# Altium schematic sheet Archim_TF_Bottom.SchDoc
size Tabloid
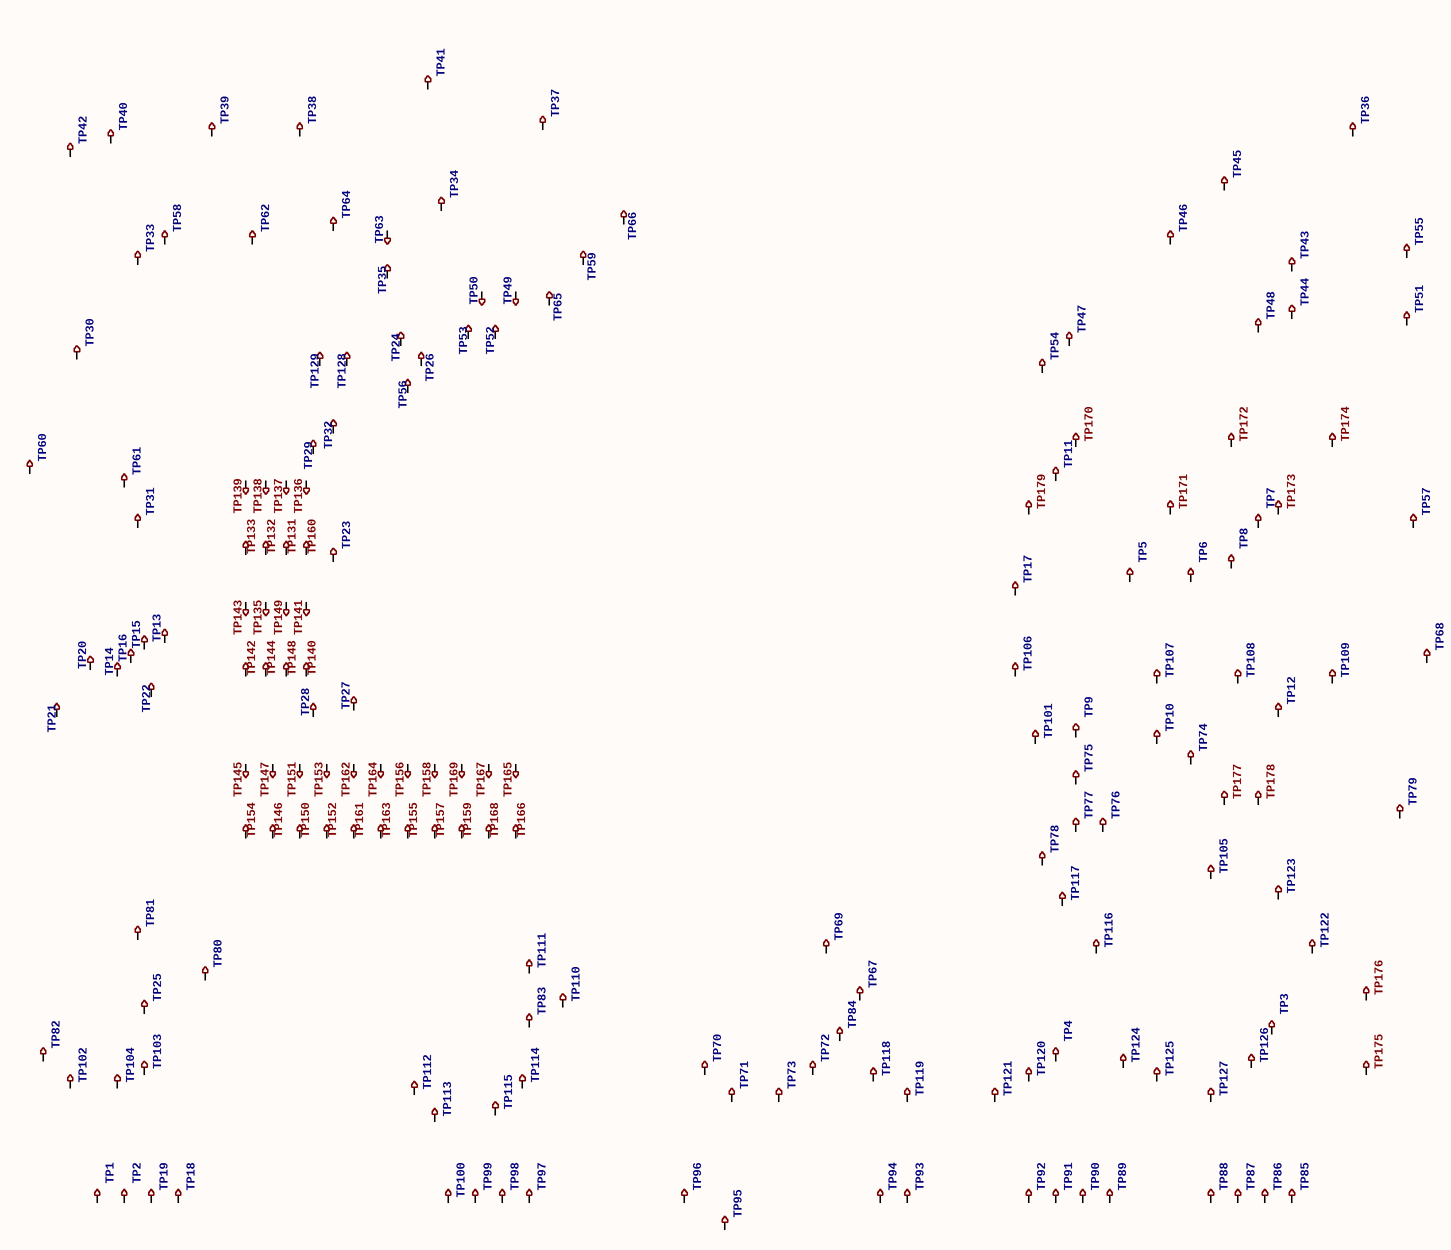
[diagram p0: Archim_TF_Bottom.SchDoc]

## Parts
TP1  P100-T  [POGO_38]  (value not drawn)  (no BOM)
TP2  P100-T  [POGO_38]  (value not drawn)  (no BOM)
TP3  P100-T  [POGO_38]  (value not drawn)  (no BOM)
TP4  P100-T  [POGO_38]  (value not drawn)  (no BOM)
TP5  P100-T  [POGO_38]  (value not drawn)  (no BOM)
TP6  P100-T  [POGO_38]  (value not drawn)  (no BOM)
TP7  P100-T  [POGO_38]  (value not drawn)  (no BOM)
TP8  P100-T  [POGO_38]  (value not drawn)  (no BOM)
TP9  P100-T  [POGO_38]  (value not drawn)  (no BOM)
TP10  P100-T  [POGO_38]  (value not drawn)  (no BOM)
TP11  P100-T  [POGO_38]  (value not drawn)  (no BOM)
TP12  P100-T  [POGO_38]  (value not drawn)  (no BOM)
TP13  P100-T  [POGO_38]  (value not drawn)  (no BOM)
TP14  P100-T  [POGO_38]  (value not drawn)  (no BOM)
TP15  P100-T  [POGO_38]  (value not drawn)  (no BOM)
TP16  P100-T  [POGO_38]  (value not drawn)  (no BOM)
TP17  P100-T  [POGO_38]  (value not drawn)  (no BOM)
TP18  P100-T  [POGO_38]  (value not drawn)  (no BOM)
TP19  P100-T  [POGO_38]  (value not drawn)  (no BOM)
TP20  P100-T  [POGO_38]  (value not drawn)  (no BOM)
TP21  P100-T  [POGO_38]  (value not drawn)  (no BOM)
TP22  P100-T  [POGO_38]  (value not drawn)  (no BOM)
TP23  P100-T  [POGO_38]  (value not drawn)  (no BOM)
TP24  P100-T  [POGO_38]  (value not drawn)  (no BOM)
TP25  P100-T  [POGO_38]  (value not drawn)  (no BOM)
TP26  P100-T  [POGO_38]  (value not drawn)  (no BOM)
TP27  P100-T  [POGO_38]  (value not drawn)  (no BOM)
TP28  P100-T  [POGO_38]  (value not drawn)  (no BOM)
TP29  P100-T  [POGO_38]  (value not drawn)  (no BOM)
TP30  P100-T  [POGO_38]  (value not drawn)  (no BOM)
TP31  P100-T  [POGO_38]  (value not drawn)  (no BOM)
TP32  P100-T  [POGO_38]  (value not drawn)  (no BOM)
TP33  P100-T  [POGO_38]  (value not drawn)  (no BOM)
TP34  P100-T  [POGO_38]  (value not drawn)  (no BOM)
TP35  P100-T  [POGO_38]  (value not drawn)  (no BOM)
TP36  P100-T  [POGO_38]  (value not drawn)  (no BOM)
TP37  P100-T  [POGO_38]  (value not drawn)  (no BOM)
TP38  P100-T  [POGO_38]  (value not drawn)  (no BOM)
TP39  P100-T  [POGO_38]  (value not drawn)  (no BOM)
TP40  P100-T  [POGO_38]  (value not drawn)  (no BOM)
TP41  P100-T  [POGO_38]  (value not drawn)  (no BOM)
TP42  P100-T  [POGO_38]  (value not drawn)  (no BOM)
TP43  P100-T  [POGO_38]  (value not drawn)  (no BOM)
TP44  P100-T  [POGO_38]  (value not drawn)  (no BOM)
TP45  P100-T  [POGO_38]  (value not drawn)  (no BOM)
TP46  P100-T  [POGO_38]  (value not drawn)  (no BOM)
TP47  P100-T  [POGO_38]  (value not drawn)  (no BOM)
TP48  P100-T  [POGO_38]  (value not drawn)  (no BOM)
TP49  P100-T  [POGO_38]  (value not drawn)  (no BOM)
TP50  P100-T  [POGO_38]  (value not drawn)  (no BOM)
TP51  P100-T  [POGO_38]  (value not drawn)  (no BOM)
TP52  P100-T  [POGO_38]  (value not drawn)  (no BOM)
TP53  P100-T  [POGO_38]  (value not drawn)  (no BOM)
TP54  P100-T  [POGO_38]  (value not drawn)  (no BOM)
TP55  P100-T  [POGO_38]  (value not drawn)  (no BOM)
TP56  P100-T  [POGO_38]  (value not drawn)  (no BOM)
TP57  P100-T  [POGO_38]  (value not drawn)  (no BOM)
TP58  P100-T  [POGO_38]  (value not drawn)  (no BOM)
TP59  P100-T  [POGO_38]  (value not drawn)  (no BOM)
TP60  P100-T  [POGO_38]  (value not drawn)  (no BOM)
TP61  P100-T  [POGO_38]  (value not drawn)  (no BOM)
TP62  P100-T  [POGO_38]  (value not drawn)  (no BOM)
TP63  P100-T  [POGO_38]  (value not drawn)  (no BOM)
TP64  P100-T  [POGO_38]  (value not drawn)  (no BOM)
TP65  P100-T  [POGO_38]  (value not drawn)  (no BOM)
TP66  P100-T  [POGO_38]  (value not drawn)  (no BOM)
TP67  P100-T  [POGO_38]  (value not drawn)  (no BOM)
TP68  P100-T  [POGO_38]  (value not drawn)  (no BOM)
TP69  P100-T  [POGO_38]  (value not drawn)  (no BOM)
TP70  P100-T  [POGO_38]  (value not drawn)  (no BOM)
TP71  P100-T  [POGO_38]  (value not drawn)  (no BOM)
TP72  P100-T  [POGO_38]  (value not drawn)  (no BOM)
TP73  P100-T  [POGO_38]  (value not drawn)  (no BOM)
TP74  P100-T  [POGO_38]  (value not drawn)  (no BOM)
TP75  P100-T  [POGO_38]  (value not drawn)  (no BOM)
TP76  P100-T  [POGO_38]  (value not drawn)  (no BOM)
TP77  P100-T  [POGO_38]  (value not drawn)  (no BOM)
TP78  P100-T  [POGO_38]  (value not drawn)  (no BOM)
TP79  P100-T  [POGO_38]  (value not drawn)  (no BOM)
TP80  P100-T  [POGO_38]  (value not drawn)  (no BOM)
TP81  P100-T  [POGO_38]  (value not drawn)  (no BOM)
TP82  P100-T  [POGO_38]  (value not drawn)  (no BOM)
TP83  P100-T  [POGO_38]  (value not drawn)  (no BOM)
TP84  P100-T  [POGO_38]  (value not drawn)  (no BOM)
TP85  P100-T  [POGO_38]  (value not drawn)  (no BOM)
TP86  P100-T  [POGO_38]  (value not drawn)  (no BOM)
TP87  P100-T  [POGO_38]  (value not drawn)  (no BOM)
TP88  P100-T  [POGO_38]  (value not drawn)  (no BOM)
TP89  P100-T  [POGO_38]  (value not drawn)  (no BOM)
TP90  P100-T  [POGO_38]  (value not drawn)  (no BOM)
TP91  P100-T  [POGO_38]  (value not drawn)  (no BOM)
TP92  P100-T  [POGO_38]  (value not drawn)  (no BOM)
TP93  P100-T  [POGO_38]  (value not drawn)  (no BOM)
TP94  P100-T  [POGO_38]  (value not drawn)  (no BOM)
TP95  P100-T  [POGO_38]  (value not drawn)  (no BOM)
TP96  P100-T  [POGO_38]  (value not drawn)  (no BOM)
TP97  P100-T  [POGO_38]  (value not drawn)  (no BOM)
TP98  P100-T  [POGO_38]  (value not drawn)  (no BOM)
TP99  P100-T  [POGO_38]  (value not drawn)  (no BOM)
TP100  P100-T  [POGO_38]  (value not drawn)  (no BOM)
TP101  P100-T  [POGO_38]  (value not drawn)  (no BOM)
TP102  P100-T  [POGO_38]  (value not drawn)  (no BOM)
TP103  P100-T  [POGO_38]  (value not drawn)  (no BOM)
TP104  P100-T  [POGO_38]  (value not drawn)  (no BOM)
TP105  P100-T  [POGO_38]  (value not drawn)  (no BOM)
TP106  P100-T  [POGO_38]  (value not drawn)  (no BOM)
TP107  P100-T  [POGO_38]  (value not drawn)  (no BOM)
TP108  P100-T  [POGO_38]  (value not drawn)  (no BOM)
TP109  P100-T  [POGO_38]  (value not drawn)  (no BOM)
TP110  P100-T  [POGO_38]  (value not drawn)  (no BOM)
TP111  P100-T  [POGO_38]  (value not drawn)  (no BOM)
TP112  P100-T  [POGO_38]  (value not drawn)  (no BOM)
TP113  P100-T  [POGO_38]  (value not drawn)  (no BOM)
TP114  P100-T  [POGO_38]  (value not drawn)  (no BOM)
TP115  P100-T  [POGO_38]  (value not drawn)  (no BOM)
TP116  P100-T  [POGO_38]  (value not drawn)  (no BOM)
TP117  P100-T  [POGO_38]  (value not drawn)  (no BOM)
TP118  P100-T  [POGO_38]  (value not drawn)  (no BOM)
TP119  P100-T  [POGO_38]  (value not drawn)  (no BOM)
TP120  P100-T  [POGO_38]  (value not drawn)  (no BOM)
TP121  P100-T  [POGO_38]  (value not drawn)  (no BOM)
TP122  P100-T  [POGO_38]  (value not drawn)  (no BOM)
TP123  P100-T  [POGO_38]  (value not drawn)  (no BOM)
TP124  P100-T  [POGO_38]  (value not drawn)  (no BOM)
TP125  P100-T  [POGO_38]  (value not drawn)  (no BOM)
TP126  P100-T  [POGO_38]  (value not drawn)  (no BOM)
TP127  P100-T  [POGO_38]  (value not drawn)  (no BOM)
TP128  P100-T  [POGO_38]  (value not drawn)  (no BOM)
TP129  P100-T  [POGO_38]  (value not drawn)  (no BOM)
TP131  P100-T  [POGO_38]  (value not drawn)  (no BOM)
TP132  P100-T  [POGO_38]  (value not drawn)  (no BOM)
TP133  P100-T  [POGO_38]  (value not drawn)  (no BOM)
TP135  P100-T  [POGO_38]  (value not drawn)  (no BOM)
TP136  P100-T  [POGO_38]  (value not drawn)  (no BOM)
TP137  P100-T  [POGO_38]  (value not drawn)  (no BOM)
TP138  P100-T  [POGO_38]  (value not drawn)  (no BOM)
TP139  P100-T  [POGO_38]  (value not drawn)  (no BOM)
TP140  P100-T  [POGO_38]  (value not drawn)  (no BOM)
TP141  P100-T  [POGO_38]  (value not drawn)  (no BOM)
TP142  P100-T  [POGO_38]  (value not drawn)  (no BOM)
TP143  P100-T  [POGO_38]  (value not drawn)  (no BOM)
TP144  P100-T  [POGO_38]  (value not drawn)  (no BOM)
TP145  P100-T  [POGO_38]  (value not drawn)  (no BOM)
TP146  P100-T  [POGO_38]  (value not drawn)  (no BOM)
TP147  P100-T  [POGO_38]  (value not drawn)  (no BOM)
TP148  P100-T  [POGO_38]  (value not drawn)  (no BOM)
TP149  P100-T  [POGO_38]  (value not drawn)  (no BOM)
TP150  P100-T  [POGO_38]  (value not drawn)  (no BOM)
TP151  P100-T  [POGO_38]  (value not drawn)  (no BOM)
TP152  P100-T  [POGO_38]  (value not drawn)  (no BOM)
TP153  P100-T  [POGO_38]  (value not drawn)  (no BOM)
TP154  P100-T  [POGO_38]  (value not drawn)  (no BOM)
TP155  P100-T  [POGO_38]  (value not drawn)  (no BOM)
TP156  P100-T  [POGO_38]  (value not drawn)  (no BOM)
TP157  P100-T  [POGO_38]  (value not drawn)  (no BOM)
TP158  P100-T  [POGO_38]  (value not drawn)  (no BOM)
TP159  P100-T  [POGO_38]  (value not drawn)  (no BOM)
TP160  P100-T  [POGO_38]  (value not drawn)  (no BOM)
TP161  P100-T  [POGO_38]  (value not drawn)  (no BOM)
TP162  P100-T  [POGO_38]  (value not drawn)  (no BOM)
TP163  P100-T  [POGO_38]  (value not drawn)  (no BOM)
TP164  P100-T  [POGO_38]  (value not drawn)  (no BOM)
TP165  P100-T  [POGO_38]  (value not drawn)  (no BOM)
TP166  P100-T  [POGO_38]  (value not drawn)  (no BOM)
TP167  P100-T  [POGO_38]  (value not drawn)  (no BOM)
TP168  P100-T  [POGO_38]  (value not drawn)  (no BOM)
TP169  P100-T  [POGO_38]  (value not drawn)  (no BOM)
TP170  P100-T  [POGO_38]  (value not drawn)  (no BOM)
TP171  P100-T  [POGO_38]  (value not drawn)  (no BOM)
TP172  P100-T  [POGO_38]  (value not drawn)  (no BOM)
TP173  P100-T  [POGO_38]  (value not drawn)  (no BOM)
TP174  P100-T  [POGO_38]  (value not drawn)  (no BOM)
TP175  P100-T  [POGO_38]  (value not drawn)  (no BOM)
TP176  P100-T  [POGO_38]  (value not drawn)  (no BOM)
TP177  P100-T  [POGO_38]  (value not drawn)  (no BOM)
TP178  P100-T  [POGO_38]  (value not drawn)  (no BOM)
TP179  P100-T  [POGO_38]  (value not drawn)  (no BOM)

## Nets

Not connected (* = marked no-connect by the designer): TP1 1(TP); TP2 1(TP); TP3 1(TP); TP4 1(TP); TP5 1(TP); TP6 1(TP); TP7 1(TP); TP8 1(TP); TP9 1(TP); TP10 1(TP); TP11 1(TP); TP12 1(TP); TP13 1(TP); TP14 1(TP); TP15 1(TP); TP16 1(TP); TP17 1(TP); TP18 1(TP); TP19 1(TP); TP20 1(TP); TP21 1(TP); TP22 1(TP); TP23 1(TP); TP24 1(TP); TP25 1(TP); TP26 1(TP); TP27 1(TP); TP28 1(TP); TP29 1(TP); TP30 1(TP); TP31 1(TP); TP32 1(TP); TP33 1(TP); TP34 1(TP); TP35 1(TP); TP36 1(TP); TP37 1(TP); TP38 1(TP); TP39 1(TP); TP40 1(TP); TP41 1(TP); TP42 1(TP); TP43 1(TP); TP44 1(TP); TP45 1(TP); TP46 1(TP); TP47 1(TP); TP48 1(TP); TP49 1(TP); TP50 1(TP); TP51 1(TP); TP52 1(TP); TP53 1(TP); TP54 1(TP); TP55 1(TP); TP56 1(TP); TP57 1(TP); TP58 1(TP); TP59 1(TP); TP60 1(TP); TP61 1(TP); TP62 1(TP); TP63 1(TP); TP64 1(TP); TP65 1(TP); TP66 1(TP); TP67 1(TP); TP68 1(TP); TP69 1(TP); TP70 1(TP); TP71 1(TP); TP72 1(TP); TP73 1(TP); TP74 1(TP); TP75 1(TP); TP76 1(TP); TP77 1(TP); TP78 1(TP); TP79 1(TP); TP80 1(TP); TP81 1(TP); TP82 1(TP); TP83 1(TP); TP84 1(TP); TP85 1(TP); TP86 1(TP); TP87 1(TP); TP88 1(TP); TP89 1(TP); TP90 1(TP); TP91 1(TP); TP92 1(TP); TP93 1(TP); TP94 1(TP); TP95 1(TP); TP96 1(TP); TP97 1(TP); TP98 1(TP); TP99 1(TP); TP100 1(TP); TP101 1(TP); TP102 1(TP); TP103 1(TP); TP104 1(TP); TP105 1(TP); TP106 1(TP); TP107 1(TP); TP108 1(TP); TP109 1(TP); TP110 1(TP); TP111 1(TP); TP112 1(TP); TP113 1(TP); TP114 1(TP); TP115 1(TP); TP116 1(TP); TP117 1(TP); TP118 1(TP); TP119 1(TP); TP120 1(TP); TP121 1(TP); TP122 1(TP); TP123 1(TP); TP124 1(TP); TP125 1(TP); TP126 1(TP); TP127 1(TP); TP128 1(TP); TP129 1(TP); TP131 1(TP); TP132 1(TP); TP133 1(TP); TP135 1(TP); TP136 1(TP); TP137 1(TP); TP138 1(TP); TP139 1(TP); TP140 1(TP); TP141 1(TP); TP142 1(TP); TP143 1(TP); TP144 1(TP); TP145 1(TP); TP146 1(TP); TP147 1(TP); TP148 1(TP); TP149 1(TP); TP150 1(TP); TP151 1(TP); TP152 1(TP); TP153 1(TP); TP154 1(TP); TP155 1(TP); TP156 1(TP); TP157 1(TP); TP158 1(TP); TP159 1(TP); TP160 1(TP); TP161 1(TP); TP162 1(TP); TP163 1(TP); TP164 1(TP); TP165 1(TP); TP166 1(TP); TP167 1(TP); TP168 1(TP); TP169 1(TP); TP170 1(TP); TP171 1(TP); TP172 1(TP); TP173 1(TP); TP174 1(TP); TP175 1(TP); TP176 1(TP); TP177 1(TP); TP178 1(TP); TP179 1(TP)

## Library data of the parts
TP1-TP129 TP131-TP133 TP135-TP179 = TestPoint: Test Point; LastRevisionNote: ImportComponents; Published: 23-Apr-2014; Publisher: UltiMachine; LastRevisionDate: 23-Apr-2014